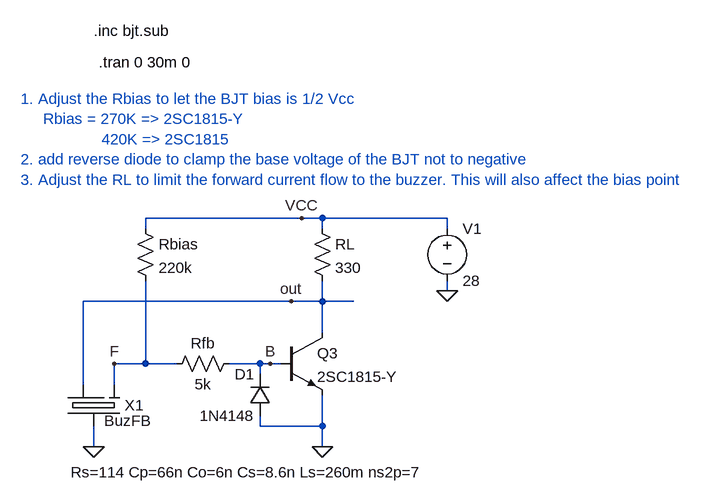
[diagram p0: schematic oscillator test_bjt-1.asc]
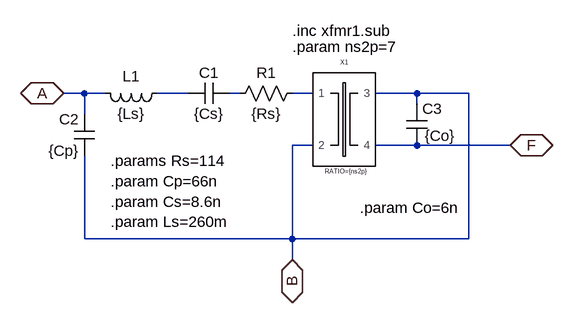
[diagram p1: sub-circuit buzfb.asc]
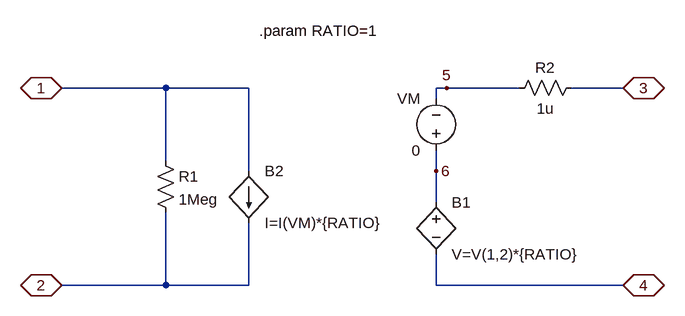
[diagram p2: sub-circuit xmfr1.asc]
oscillator test_bjt-1.asc, the LTspice schematic file:
Version 4
SHEET 1 2144 1132
WIRE 256 128 16 128
WIRE 288 128 256 128
WIRE 480 128 288 128
WIRE 16 144 16 128
WIRE 288 144 288 128
WIRE 480 144 480 128
WIRE 480 240 480 224
WIRE 240 256 -80 256
WIRE 288 256 288 224
WIRE 288 256 240 256
WIRE 336 256 288 256
WIRE 288 304 288 256
WIRE 16 352 16 224
WIRE 16 352 -32 352
WIRE 64 352 16 352
WIRE 192 352 144 352
WIRE 208 352 192 352
WIRE 224 352 208 352
WIRE 192 368 192 352
WIRE -80 384 -80 256
WIRE -32 384 -32 352
WIRE 192 448 192 432
WIRE 288 448 288 400
WIRE 288 448 192 448
WIRE -64 480 -64 448
WIRE 288 480 288 448
FLAG 288 480 0
FLAG 480 240 0
FLAG -32 352 F
FLAG 208 352 B
FLAG 256 128 VCC
FLAG -64 480 0
FLAG 240 256 out
DATAFLAG 336 256 ""
SYMBOL res 48 368 R270
WINDOW 0 32 56 VTop 2
WINDOW 3 0 56 VBottom 2
SYMATTR InstName Rfb
SYMATTR Value 5k
SYMBOL res 0 128 R0
SYMATTR InstName Rbias
SYMATTR Value 220k
SYMBOL res 272 128 R0
SYMATTR InstName RL
SYMATTR Value 330
SYMBOL voltage 480 128 R0
WINDOW 123 0 0 Left 0
WINDOW 39 0 0 Left 0
SYMATTR InstName V1
SYMATTR Value 28
SYMBOL BuzFB -64 416 R0
WINDOW 39 -35 103 Left 2
SYMATTR InstName X1
SYMBOL npn 224 304 R0
SYMATTR InstName Q3
SYMATTR Value 2SC1815-Y
SYMBOL diode 208 432 R180
WINDOW 0 24 64 Left 2
WINDOW 3 24 0 Left 2
SYMATTR InstName D1
SYMATTR Value 1N4148
TEXT -56 -112 Left 2 !.tran 0 30m 0
TEXT -64 -160 Left 2 !.inc bjt.sub
TEXT -176 -56 Left 2 ;1. Adjust the Rbias to let the BJT bias is 1/2 Vcc\n     Rbias = 270K => 2SC1815-Y\n                  420K => 2SC1815\n2. add reverse diode to clamp the base voltage of the BJT not to negative\n3. Adjust the RL to limit the forward current flow to the buzzer. This will also affect the bias point

buzfb.asc, the sub-circuit schematic file:
Version 4
SHEET 1 880 680
WIRE -144 -48 -176 -48
WIRE -112 -48 -144 -48
WIRE 16 -48 -32 -48
WIRE 96 -48 80 -48
WIRE 208 -48 176 -48
WIRE 368 -48 304 -48
WIRE 448 -48 368 -48
WIRE 368 -32 368 -48
WIRE -144 -16 -144 -48
WIRE 208 32 176 32
WIRE 368 32 304 32
WIRE 512 32 368 32
WIRE -144 176 -144 48
WIRE 176 176 176 32
WIRE 176 176 -144 176
WIRE 448 176 448 -48
WIRE 448 176 176 176
WIRE 176 208 176 176
FLAG 512 32 F
IOPIN 512 32 BiDir
FLAG -176 -48 A
IOPIN -176 -48 BiDir
FLAG 176 208 B
IOPIN 176 208 BiDir
SYMBOL cap -128 48 R180
WINDOW 0 24 56 Left 2
WINDOW 3 24 8 Left 2
SYMATTR InstName C2
SYMATTR Value {Cp}
SYMBOL cap 352 -32 R0
WINDOW 3 28 49 Left 2
SYMATTR Value {Co}
SYMATTR InstName C3
SYMBOL ind -16 -64 R90
WINDOW 0 5 56 VBottom 2
WINDOW 3 32 56 VTop 2
SYMATTR InstName L1
SYMATTR Value {Ls}
SYMBOL res 192 -64 R90
WINDOW 0 0 56 VBottom 2
WINDOW 3 32 56 VTop 2
SYMATTR InstName R1
SYMATTR Value {Rs}
SYMBOL cap 80 -64 R90
WINDOW 0 0 32 VBottom 2
WINDOW 3 32 32 VTop 2
SYMATTR InstName C1
SYMATTR Value {Cs}
SYMBOL XMFR1 256 -16 R0
SYMATTR InstName X1
SYMATTR SpiceLine RATIO={ns2p}
TEXT -104 56 Left 2 !.params Rs=114\n.param Cp=66n\n.param Cs=8.6n\n.param Ls=260m
TEXT 176 -120 Left 2 !.param ns2p=7
TEXT 176 -144 Left 2 !.inc xfmr1.sub
TEXT 280 128 Left 2 !.param Co=6n

xmfr1.asc, the sub-circuit schematic file:
Version 4
SHEET 1 880 680
WIRE 64 -112 -96 -112
WIRE 192 -112 64 -112
WIRE 496 -112 480 -112
WIRE 608 -112 496 -112
WIRE 768 -112 688 -112
WIRE 480 -96 480 -112
WIRE 64 0 64 -112
WIRE 192 16 192 -112
WIRE 480 16 480 -16
WIRE 480 64 480 16
WIRE 64 192 64 80
WIRE 64 192 -96 192
WIRE 192 192 192 96
WIRE 192 192 64 192
WIRE 480 192 480 144
WIRE 768 192 480 192
FLAG -96 -112 1
IOPIN -96 -112 BiDir
FLAG -96 192 2
IOPIN -96 192 BiDir
FLAG 768 -112 3
IOPIN 768 -112 BiDir
FLAG 768 192 4
IOPIN 768 192 BiDir
FLAG 496 -112 5
FLAG 480 16 6
SYMBOL res 48 -16 R0
SYMATTR InstName R1
SYMATTR Value 1Meg
SYMBOL res 704 -128 R90
WINDOW 0 0 56 VBottom 2
WINDOW 3 32 56 VTop 2
SYMATTR InstName R2
SYMATTR Value 1u
SYMBOL voltage 480 0 R180
WINDOW 0 24 96 Left 2
WINDOW 3 24 16 Left 2
WINDOW 123 0 0 Left 0
WINDOW 39 0 0 Left 0
SYMATTR InstName VM
SYMATTR Value 0
SYMBOL bv 480 48 R0
SYMATTR InstName B1
SYMATTR Value V=V(1,2)*{RATIO}
SYMBOL bi 192 16 R0
SYMATTR InstName B2
SYMATTR Value I=I(VM)*{RATIO}
TEXT 208 -200 Left 2 !.param RATIO=1

The netlist it stands for:
* oscillator test_bjt-1.asc
Rfb F B 5k
Rbias VCC F 220k
RL VCC out 330
V1 VCC 0 28
XX1 out 0 F buzfb params: BuzFB Rs=114 Cp=66n Co=6n Cs=8.6n Ls=260m ns2p=7
Q3 out B 0 0 2SC1815-Y
D1 0 B 1N4148

* block symbol definitions
.subckt buzfb A B F
C2 B A {Cp}
C3 B F {Co}
L1 N001 A {Ls}
R1 N003 N002 {Rs}
C1 N002 N001 {Cs}
XX1 N003 B B F xmfr1 params: RATIO={ns2p}
.params Rs=114
.param Cp=66n
.param Cs=8.6n
.param Ls=260m
.param ns2p=7
.inc xfmr1.sub
.param Co=6n
.ends buzfb

.subckt xmfr1 1 2 3 4
R1 1 2 1Meg
R2 3 5 1u
VM 6 5 0
B1 6 4 V=V(1,2)*{RATIO}
B2 1 2 I=I(VM)*{RATIO}
.param RATIO=1
.ends xmfr1

.model D D
.lib standard.dio
.model NPN NPN
.model PNP PNP
.lib standard.bjt
.tran 0 30m 0
.inc bjt.sub
* 1. Adjust the Rbias to let the BJT bias is 1/2 Vcc
*      Rbias = 270K => 2SC1815-Y
*                   420K => 2SC1815
* 2. add reverse diode to clamp the base voltage of the BJT not to negative
* 3. Adjust the RL to limit the forward current flow to the buzzer. This will also affect the bias point
.backanno
.end